# EAGLE design powerlog (EAGLE 5.11)
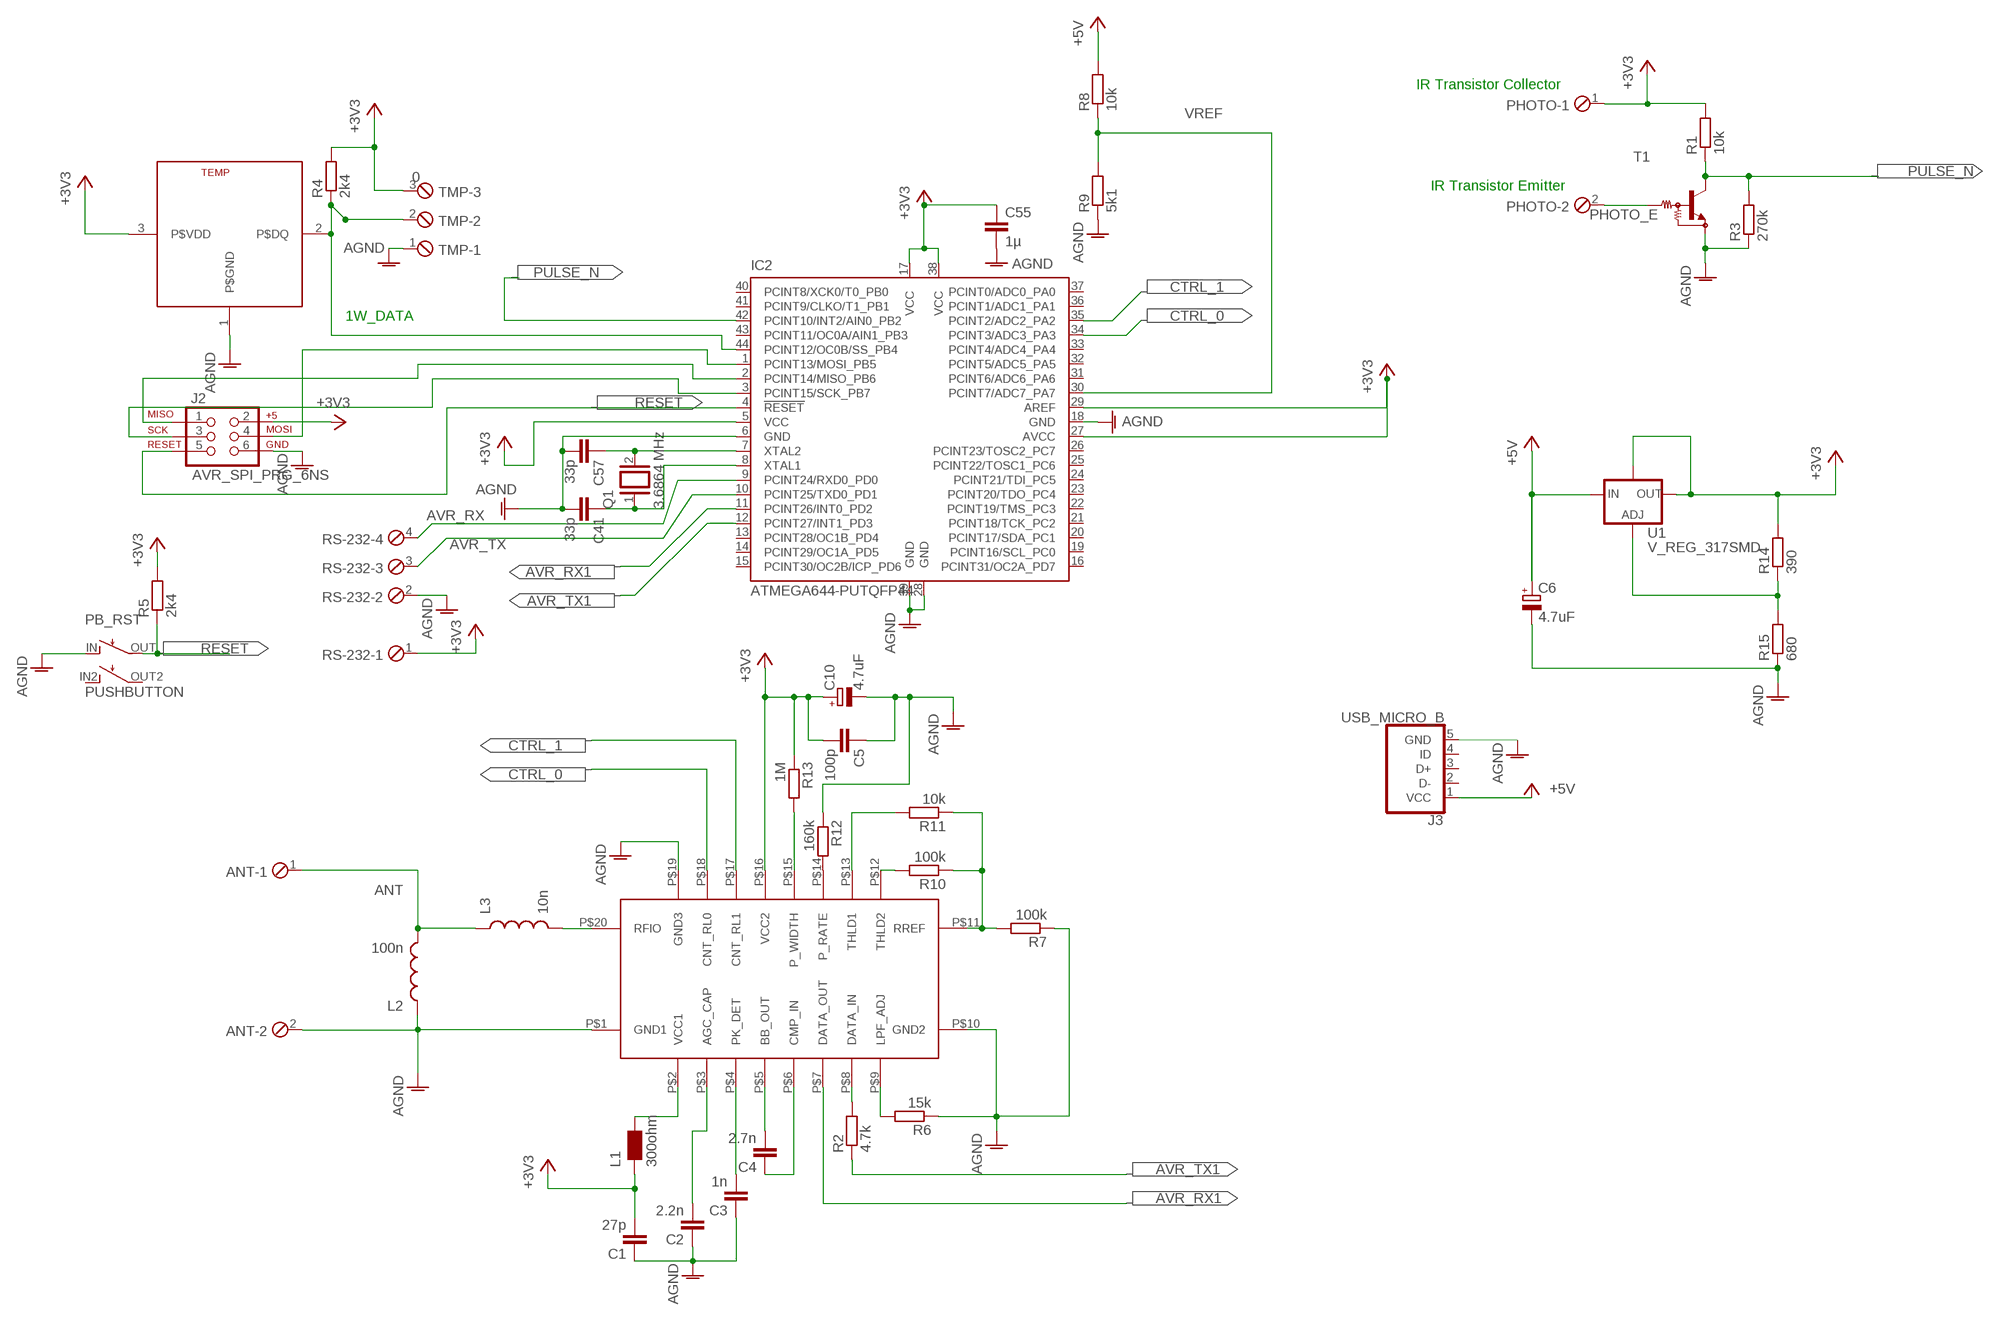
[diagram p0: schematic, sheet 1]

## Parts
ANT  MPT2  [2POL254]
C1  27p  C-EUC0603  [C0603]
C2  2.2n  C-EUC0603  [C0603]
C3  1n  C-EUC0603  [C0603]
C4  2.7n  C-EUC0603  [C0603]
C5  100p  C-EUC0603  [C0603]
C6  4.7uF  CAP_SMBB  [SMC_CAP_B]
C10  4.7uF  CAP_SMBB  [SMC_CAP_B]
C41  33p  C-EUC0603  [C0603]
C55  1µ  C-EUC0805  [C0805]
C57  33p  C-EUC0603  [C0603]
IC2  ATMEGA644-PUTQFP44  [TQFP44]
J2  AVR_SPI_PRG_6NS  [2X3-NS]
J3  USB_MICRO_B  [USB_MICRO_B]
L1  300ohm  WE-CBF_0603  [0603]
L2  100n  INDUCTOR_SMD  [0805]
L3  10n  INDUCTOR_SMD  [0805]
PB_RST  PUSHBUTTON  [PUSHBUTTON]
PHOTO  MPT2  [2POL254]
Q1  3.6864 MHz  XTAL  [Q]
R1  10k  R-EU_R0603  [R0603]
R2  4.7k  R-EU_R0603  [R0603]
R3  270k  R-EU_R0603  [R0603]
R4  2k4  R-EU_R0603  [R0603]
R5  2k4  R-EU_R0603  [R0603]
R6  15k  R-EU_R0603  [R0603]
R7  100k  R-EU_R0603  [R0603]
R8  10k  R-EU_R0603  [R0603]
R9  5k1  R-EU_R0603  [R0603]
R10  100k  R-EU_R0603  [R0603]
R11  10k  R-EU_R0603  [R0603]
R12  160k  R-EU_R0603  [R0603]
R13  1M  R-EU_R0603  [R0603]
R14  390  R-EU_R0603  [R0603]
R15  680  R-EU_R0603  [R0603]
RS-232  MPT4  [4POL254]
T1  NPN-DRIVER  [SC59_EBC]
TEMP  DS18S20T  [TO92-]
TMP  0  MPT3  [3POL254]
U1  V_REG_317SMD  [SOT223]
U$2  TR1001  [TR1001]

## Nets
1W_DATA: IC2.44(PCINT12/OC0B/SS_PB4) R4.1 TEMP.2(P$DQ) TMP.2
+3V3: C1.2 C5.2 C10.+ C55.1 IC2.5(VCC) IC2.17(VCC) IC2.27(AVCC) IC2.29(AREF) IC2.38(VCC) J2.2 L1.1 PHOTO.1 R1.2 R4.2 R5.2 R13.1 R14.2 RS-232.1 TEMP.3(P$VDD) TMP.3 U1.2(OUT) U1.4(OUT_TOP) U$2.P$16(VCC2)
+5V: C6.+ J3.1(VCC) R8.2 U1.3(IN)
AGND: ANT.2 C1.1 C2.1 C3.1 C5.1 C6.- C10.- C41.2 C55.2 C57.2 IC2.6(GND) IC2.18(GND) IC2.28(GND) IC2.39(GND) J2.6 J3.5(GND) L2.1 PB_RST.IN R3.1 R6.1 R7.1 R9.1 R12.1 R15.1 RS-232.2 T1.E TEMP.1(P$GND) TMP.1 U$2.P$1(GND1) U$2.P$10(GND2) U$2.P$19(GND3)
ANT: ANT.1 L2.2 L3.1
AVR_RX: IC2.9(PCINT24/RXD0_PD0) RS-232.4
AVR_RX1: IC2.11(PCINT26/INT0_PD2) U$2.P$7(DATA_OUT)
AVR_TX: IC2.10(PCINT25/TXD0_PD1) RS-232.3
AVR_TX1: IC2.12(PCINT27/INT1_PD3) R2.1
CTRL_0: IC2.34(PCINT3/ADC3_PA3) U$2.P$18(CNT_RL0)
CTRL_1: IC2.35(PCINT2/ADC2_PA2) U$2.P$17(CNT_RL1)
MISO: IC2.2(PCINT14/MISO_PB6) J2.1
MOSI: IC2.1(PCINT13/MOSI_PB5) J2.4
N$1: L3.2 U$2.P$20(RFIO)
N$2: L1.2 U$2.P$2(VCC1)
N$4: C2.2 U$2.P$3(AGC_CAP)
N$5: C3.2 U$2.P$4(PK_DET)
N$6: R14.1 R15.2 U1.1(ADJ)
N$7: C4.2 U$2.P$5(BB_OUT)
N$8: C4.1 U$2.P$6(CMP_IN)
N$10: R2.2 U$2.P$8(DATA_IN)
N$12: R6.2 U$2.P$9(LPF_ADJ)
N$13: R7.2 R10.1 R11.1 U$2.P$11(RREF)
N$15: R10.2 U$2.P$12(THLD2)
N$16: R11.2 U$2.P$13(THLD1)
N$17: R12.2 U$2.P$14(P_RATE)
N$18: R13.2 U$2.P$15(P_WIDTH)
PHOTO_E: PHOTO.2 T1.B
PULSE_N: IC2.42(PCINT10/INT2/AIN0_PB2) R1.1 R3.2 T1.C
RESET: IC2.4(!RESET) J2.5 PB_RST.OUT R5.1
SCK: IC2.3(PCINT15/SCK_PB7) J2.3
VREF: IC2.30(PCINT7/ADC7_PA7) R8.1 R9.2
XTAL1: C41.1 IC2.8(XTAL1) Q1.1
XTAL2: C57.1 IC2.7(XTAL2) Q1.2
Unconnected: IC2.13(PCINT28/OC1B_PD4) IC2.14(PCINT29/OC1A_PD5) IC2.15(PCINT30/OC2B/ICP_PD6) IC2.16(PCINT31/OC2A_PD7) IC2.19(PCINT16/SCL_PC0) IC2.20(PCINT17/SDA_PC1) IC2.21(PCINT18/TCK_PC2) IC2.22(PCINT19/TMS_PC3) IC2.23(PCINT20/TDO_PC4) IC2.24(PCINT21/TDI_PC5) IC2.25(PCINT22/TOSC1_PC6) IC2.26(PCINT23/TOSC2_PC7) IC2.31(PCINT6/ADC6_PA6) IC2.32(PCINT5/ADC5_PA5) IC2.33(PCINT4/ADC4_PA4) IC2.36(PCINT1/ADC1_PA1) IC2.37(PCINT0/ADC0_PA0) IC2.40(PCINT8/XCK0/T0_PB0) IC2.41(PCINT9/CLKO/T1_PB1) IC2.43(PCINT11/OC0A/AIN1_PB3) J3.2(D-) J3.3(D+) J3.4(ID) PB_RST.IN2 PB_RST.OUT2

## Notes on the sheet
- IR Transistor Collector
- IR Transistor Emitter
- 1W_DATA

## Library data of the parts
ANT PHOTO = con-phoenix-254:MPT2: PHOENIX CONNECTOR; OC_FARNELL: unknown; OC_NEWARK: unknown
C1-C5 C41 C55 C57 = rcl:C-EU: CAPACITOR, European symbol
C6 C10 = jockes_lib:CAP_SMB
IC2 = atmel:ATMEGA644-*PU: 8-bit Microcontroller with 64K Bytes In-System Programmable Flash Auto generated by make-symbol-device-package-bsdl.ulp Rev. 34 Source: http://www.atmel.com/dyn/resources/prod_documents/doc2593.pdf
J2 = SparkFun:AVR_SPI_PRG_6: AVR ISP 6 Pin This is the reduced ISP connector for AVR programming. Common on Arduino. This footprint will take up less PCB space and can be used with a 10-pin to 6-pin adapter such as SKU: BOB-08508
J3 = jockes_lib:USB_MICRO_B
L1 = wuerth-elektronik:WE-CBF: SMD EMI Suppression Ferrite Beads - excellent anti-EMI properties - low DCR - impedances till 3000 ohms - rated current up to 6 A
L2 L3 = jockes_lib:INDUCTOR_SMD
PB_RST = jockes_lib:PUSHBUTTON
Q1 = special:XTAL: CRYSTAL
R1-R15 = resistor:R-EU_: RESISTOR, European symbol
RS-232 = con-phoenix-254:MPT4: PHOENIX CONNECTOR; OC_FARNELL: unknown; OC_NEWARK: unknown
T1 = jockes_lib:NPN-DRIVER
TEMP = maxim:DS18S20
TMP = con-phoenix-254:MPT3: PHOENIX CONNECTOR; OC_FARNELL: unknown; OC_NEWARK: unknown
U1 = SparkFun:V_REG_317: Voltage Regulator Standard LM317 adjustable voltage regulator. AOI (Adjust Output Input). Google 'LM317 Calculator' for easy to use app to get the two resistor values needed. 240/720 for 5V output. 240/390 for 3.3V output. Spark Fun Electronics SKU : COM-00527
U$2 = jockes_lib:TR1001

## Board
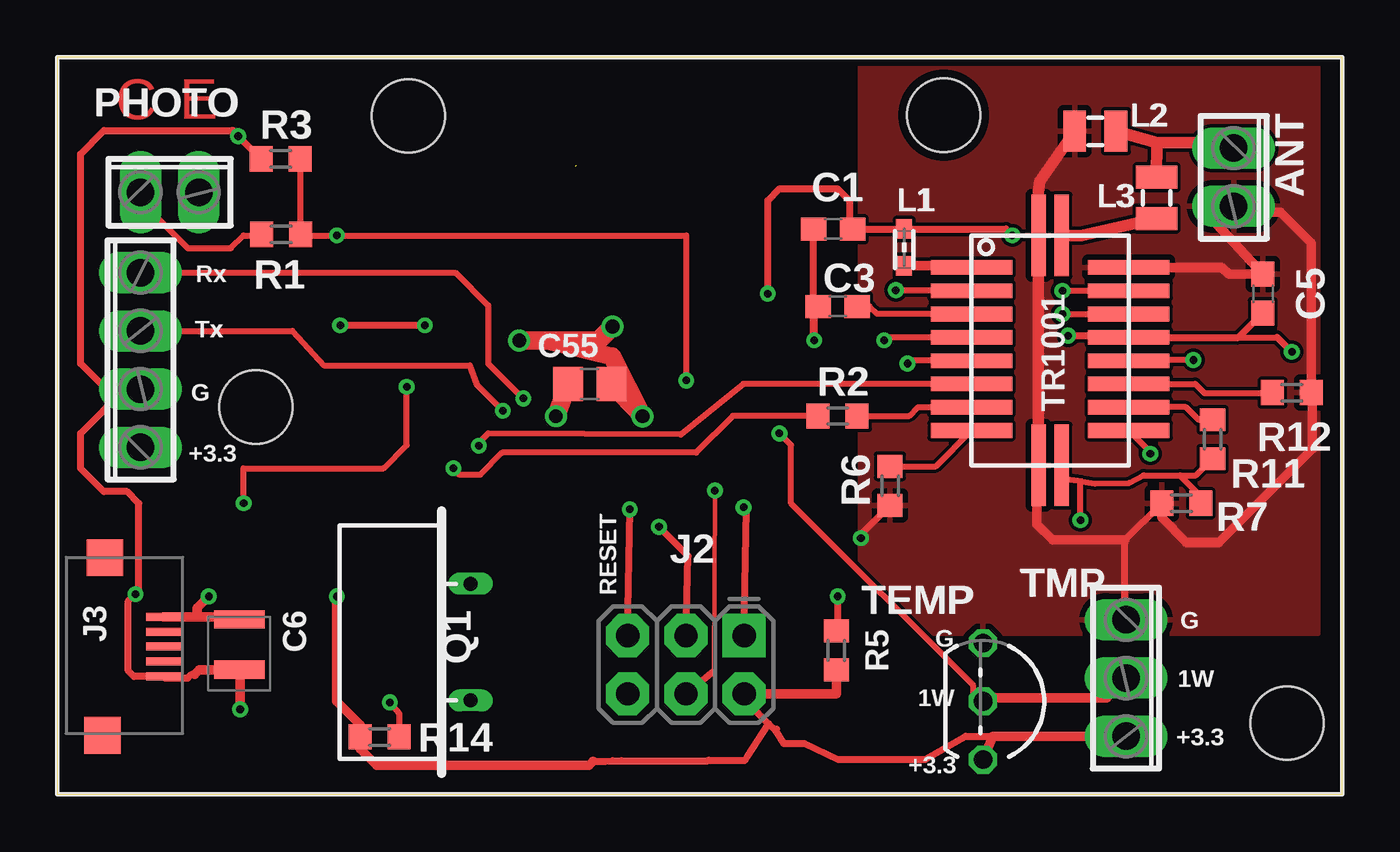
[diagram p1: board, top side]
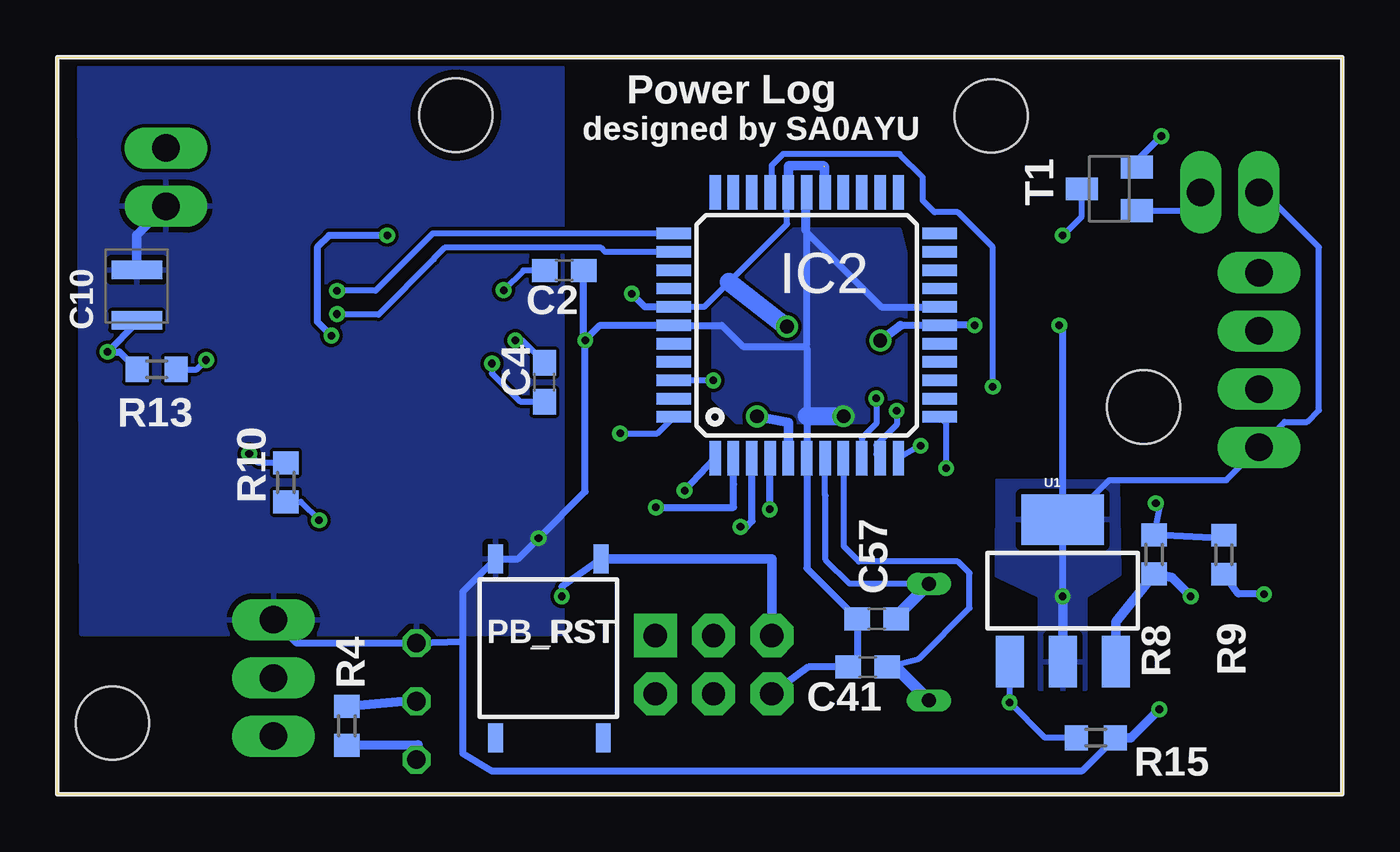
[diagram p2: board, bottom side, seen from below]

Size 56.04 x 32.16 mm. Coordinates in mm from the lower left corner, seen from the top.
Outline: 0,0 56.04,0 56.04,32.16 0,32.16 0,0
Copper layers (1*16): Top 0.0356mm / dielectric 1.5011mm / Bottom 0.0356mm
Design rules "LaenPCBOrder *": minimum track width 6mil, minimum drill 13mil, track to track 6mil, track to pad 6mil, pad to pad 6mil, via to via 6mil, smd to smd 6mil, copper to edge 15mil, drill to drill 6mil, minimum pad ring 7mil, minimum via ring 7mil, stop-mask expansion 4mil, vias tented up to drill 0mil, thermal gap 10mil
Holes 3.2 mm at 38.66,29.63 53.64,3.12 8.66,16.9 15.32,29.6

### Footprints (pad centres in the part's own frame; a part is rotated, then mirrored left to right if it is on the bottom)
2POL254 = drill 1.2 long: 1 -1.27,0; 2 1.27,0
C0603 = smd 1.1 x 1: 1 -0.85,0; 2 0.85,0
SMC_CAP_B = smd 0.8 x 2.2: + -1.37,0.3; - 0.83,0.3
C0805 = smd 1.3 x 1.5: 1 -0.95,0; 2 0.95,0
TQFP44 = smd 1.5 x 0.5: 1 -5.8,4; 2 -5.8,3.2; 3 -5.8,2.4; 4 -5.8,1.6; 5 -5.8,0.8; 6 -5.8,0; 7 -5.8,-0.8; 8 -5.8,-1.6; 9 -5.8,-2.4; 10 -5.8,-3.2; 11 -5.8,-4; 23 5.8,-4; 24 5.8,-3.2; 25 5.8,-2.4; 26 5.8,-1.6; 27 5.8,-0.8; 28 5.8,0; 29 5.8,0.8; 30 5.8,1.6; 31 5.8,2.4; 32 5.8,3.2; 33 5.8,4 | smd 0.5 x 1.5: 12 -4,-5.8; 13 -3.2,-5.8; 14 -2.4,-5.8; 15 -1.6,-5.8; 16 -0.8,-5.8; 17 0,-5.8; 18 0.8,-5.8; 19 1.6,-5.8; 20 2.4,-5.8; 21 3.2,-5.8; 22 4,-5.8; 34 4,5.8; 35 3.2,5.8; 36 2.4,5.8; 37 1.6,5.8; 38 0.8,5.8; 39 0,5.8; 40 -0.8,5.8; 41 -1.6,5.8; 42 -2.4,5.8; 43 -3.2,5.8; 44 -4,5.8
2X3-NS = drill 1.016 pad 1.88 square: 1 -2.54,-1.27 | drill 1.016 pad 1.88 octagon: 2 -2.54,1.27; 3 0,-1.27; 4 0,1.27; 5 2.54,-1.27; 6 2.54,1.27
USB_MICRO_B = smd 0.35 x 1.5: 1 -0.38,-1.58; 2 -1.03,-1.58; 3 -1.68,-1.58; 4 -2.33,-1.58; 5 -2.98,-1.58 | smd 1.6 x 1.6: 6 -5.55,1.08; 7 2.2,0.97
0603 = smd 0.85 x 0.7: 1 -0.9,0; 2 0.7,0
0805 = smd 1 x 1.8: 1 -0.87,0.02; 2 0.93,0.02
PUSHBUTTON = smd 0.635 x 1.27: IN -2.3,4.29; IN2 -2.3,-3.51; OUT 2.3,4.29; OUT2 2.4,-3.51
Q = drill 0.61 long: 1 -2.54,-7.62; 2 2.54,-7.62
R0603 = smd 1 x 1.1: 1 -0.85,0; 2 0.85,0
4POL254 = drill 1.2 long: 1 -3.81,0; 2 -1.27,0; 3 1.27,0; 4 3.81,0
SC59_EBC = smd 1 x 1.4: B -0.95,-1.2; C 0,1.2; E 0.95,-1.2
TO92- = drill 0.813 octagon: 1 -2.54,0; 2 0,0; 3 2.54,0
3POL254 = drill 1.2 long: 1 -2.54,0; 2 0,0; 3 2.54,0
SOT223 = smd 1.219 x 2.235: 1 -2.311,-3.099; 2 0,-3.099; 3 2.311,-3.099 | smd 3.6 x 2.2: 4 0,3.099
TR1001 = smd 3.556 x 0.635: P$1 0,2.921; P$10 10.033,2.921; P$11 10.033,3.937; P$20 0,3.937 | smd 0.635 x 3.556: P$2 1.397,0; P$3 2.413,0; P$4 3.429,0; P$5 4.445,0; P$6 5.461,0; P$7 6.477,0; P$8 7.493,0; P$9 8.509,0; P$12 8.509,6.858; P$13 7.493,6.858; P$14 6.477,6.858; P$15 5.461,6.858; P$16 4.445,6.858; P$17 3.429,6.858; P$18 2.413,6.858; P$19 1.397,6.858

### Placement (x,y rotation side)
ANT  51.31,26.92 270 top
C1  33.84,24.66 0 top
C2  33.93,22.86 180 bottom
C3  34.04,21.29 0 top
C4  34.8,17.98 90 bottom
C5  52.58,21.84 270 top
C6  7.64,6.27 270 top
C10  52.27,22.05 90 bottom
C41  20.69,5.56 180 bottom
C55  23.22,17.9 180 top
C57  20.3,7.66 180 bottom
IC2  23.36,20.47 90 bottom
J2  27.42,5.66 180 top
J3  3.05,8.13 90 top
L1  36.93,23.76 270 top
L2  45.24,28.91 0 top
L3  47.93,26.05 270 top
PB_RST  34.63,5.98 0 bottom
PHOTO  4.9,26.27 0 top
Q1  10.41,6.64 90 top
R1  9.77,24.43 180 top
R2  34.04,16.51 0 top
R3  9.74,27.72 0 top
R4  43.41,3 270 bottom
R5  33.98,6.29 270 top
R6  36.32,13.46 90 top
R7  49.02,12.7 0 top
R8  8.2,10.47 270 bottom
R9  5.16,10.46 90 bottom
R10  46.08,13.61 90 bottom
R11  50.39,15.49 90 top
R12  53.85,17.53 180 top
R13  51.71,18.54 0 bottom
R14  14.06,2.51 180 top
R15  10.75,2.47 180 bottom
RS-232  3.63,18.95 90 top
T1  10.16,26.42 90 bottom
TEMP  40.38,4.06 270 top
TMP  46.62,5.08 270 top
U1  12.19,8.89 0 bottom
U$2  39.88,24.38 270 top

### Tracks (layer width: path | path; a pad name or v marks a point on that pad's centre or on a via)
1W_DATA  (via drill 0.33)
  Top 0.254: 39.96,4.22 39.96,4.75 32,12.7 32,15.24 v31.5,15.75
  Top 0.406: TMP.2 46.62,5.06 45.77,4.22 39.96,4.22 TEMP.2
  Bottom 0.254: v31.5,15.75 29.87,15.75 IC2.44
  Bottom 0.406: R4.1 40.45,4.1 TEMP.2
+3V3  (via drill 0.33, 0.6)  (1 unrouted)
  Top 0.152: TEMP.3 40.39,2.03 | 24.22,1.47 24.13,1.37
  Top 0.254: PHOTO.1 3.63,25.89 5.69,23.82 7.57,23.82 8.13,24.38 8.88,24.38 R1.2 | 51.52,19.94 53.21,19.94
  Top 0.305: v24.21,20.41 24.52,20.26 | 23.37,1.43 23.91,1.44 24.22,1.47 24.6,1.47 28.39,1.47 28.41,1.49 30.02,1.49 30.11,1.66 31.02,3.08 | 31.02,3.08 31.32,2.79 | 31.02,3.08 30.56,3.54 J2.2 | 31.32,2.79 31.68,2.22 32.59,2.22 34.06,1.52 37.85,1.52 39.62,2.53 40.81,2.53 | 31.32,2.79 31.37,2.84 | v12.34,20.47 v16.03,20.47 | v30.99,21.84 30.99,25.91 31.5,26.42 34.04,26.42 34.54,25.91 34.54,24.8 C1.2 L1.1 41.38,24.66 v41.66,24.38 | v44.09,20.01 46.66,20.01 U$2.P$16 51.52,19.94 C5.2 | 53.21,19.94 v53.85,19.3
  Top 0.406: TMP.3 40.81,2.53 TEMP.3 | R5.2 33.98,4.39 J2.2 | v12.19,8.64 12.19,4.06 13.21,3.04 R14.2 13.21,1.98 13.92,1.27 23.2,1.27 23.37,1.43
  Top 0.813: v20.15,19.8 21.35,19.8 | 21.35,19.8 24.19,19.11 v25.53,16.49 C55.1 | 21.35,19.8 23.6,19.8 v24.21,20.41
  Bottom 0.254: IC2.38 27.83,21.27 26.75,22.34 24.21,24.88 24.21,26.21 IC2.29 | v12.19,8.64 12.19,11.68 10.16,13.72 5.05,13.72 RS-232.1 2.51,16.26 1.52,16.26 1.02,16.76 1.02,23.88 3.41,26.27 PHOTO.1
  Bottom 0.305: v24.21,20.41 24.47,20.56 | v12.34,20.47 12.19,20.32 v12.19,8.64 | IC2.38 30.41,21.27 v30.99,21.84 | v41.66,24.38 44.2,24.38 44.7,23.88 44.7,20.62 v44.09,20.01 | R13.1 53.33,19.3 v53.85,19.3 52.57,20.58 C10.+ | 19.26,20.46 17.55,20.46 IC2.17 v16.03,20.47
  Bottom 0.406: 19.26,20.46 v20.15,19.8 | IC2.29 24.16,27.41 24.13,27.43 22.63,27.43 | 22.58,27.38 22.58,26.29 IC2.27 | R4.2 40.31,2.17 TEMP.3 | IC2.5 24.16,16.23 v25.53,16.49 | v12.19,8.64 U1.2
  Bottom 0.813: 24.47,20.56 26.75,22.34
  pour Bottom: 13.21,4.57 13.21,8.64 15.09,9.52 15.06,13.72 9.75,13.67 9.7,9.6 11.18,8.64 11.18,4.57
+5V  (via drill 0.33)
  Top 0.406: J3.1 6.1,7.75 | 6.1,7.75 7.83,7.75 C6.+ | v6.6,8.64 6.1,8.13 6.1,7.75
  Bottom 0.406: v6.6,8.64 7.43,9.46 R8.2 9.88,7.53 U1.3
AGND  (via drill 0.33, 0.6)
  Top 0.305: 5.99,5.23 5.84,5.23 5.69,5.08 4.7,5.08 J3.5 3.34,5.15 3.1,5.38 3.1,8.43 v3.4,8.74 3.56,8.89 3.56,12.7 3.05,13.21 2.03,13.21 1.02,14.22 1.02,15.75 2.95,17.68 | 2.95,17.68 RS-232.2 | 2.95,17.68 2.13,17.68 1.02,18.8 1.02,27.94 2.03,28.96 7.62,28.96 | 7.62,28.96 7.65,28.96 v7.89,28.72 | v7.89,28.72 R3.1 | v7.89,28.72 7.86,28.72 7.62,28.96 | C3.1 33.02,21.12 v33.02,19.81 32.99,19.84 C1.1 | 46.57,7.67 46.57,11.09 R7.1 | v35.05,11.18 35.05,11.34 R6.1
  Top 0.406: TMP.1 46.57,7.67 | v7.98,3.71 7.98,5.4 C6.- 6.2,5.44 5.99,5.23 | 46.57,11.09 43.42,11.09 42.72,11.79 42.72,14.27 U$2.P$10 | R7.1 48.17,12.08 49.25,11 50.67,11 54.74,15.06 54.74,17.49 R12.1 54.7,24.04 53.34,25.4 51.56,25.4 ANT.2 50.55,24.89 C5.1 51.09,22.69 50.8,22.99 U$2.P$19
  Top 0.508: U$2.P$10 U$2.P$1 42.8,26.29 42.85,26.75 L2.1
  Top 0.813: v21.75,16.5 C55.2
  Bottom 0.305: IC2.18 20.09,21.27 23.45,24.63 23.45,26.17 IC2.28 23.36,19.64 23.45,19.55 | 23.45,19.55 26.14,19.55 27.06,20.46 IC2.39 32.37,20.47 v33.02,19.81 | 23.45,19.55 23.36,19.45 23.36,16.51 IC2.6 23.36,9.86 C57.2 21.15,5.95 C41.2 23.28,5.56 J2.6 | 38.35,6.65 TEMP.1 45.6,6.6 TMP.1 | v3.4,8.74 4.52,8.74 R9.1 | T1.E 8.96,27.64 v7.89,28.72 | C2.1 33.08,19.88 v33.02,19.81 | 38.35,6.65 38.35,1.78 37.08,1.02 11.36,1.02 R15.1 | 38.35,6.65 38.35,8.84 PB_RST.IN 35.96,10.27 v35.05,11.18 33.02,13.21 v33.02,19.81
  Bottom 0.406: TMP.1 | R15.1 9.21,2.47 v7.98,3.71 | C10.- 52.57,24.39 ANT.2
  Bottom 0.813: 23.36,16.51 v21.75,16.5
  pour Bottom: 19.3,24.64 26.92,24.64 27.43,24.13 27.43,17.27 26.42,16.26 19.56,16.26 19.05,16.76 19.05,23.62
  pour Top: 35,32 55,32 55,7 36,7 35,7
  pour Bottom: 34.01,31.7 55.09,31.7 55,7 34,7 34,31
ANT
  Top 0.508: 47.97,28.42 L3.1 | L2.2 47.97,28.42 | 47.97,28.42 51.08,28.42 ANT.1
AVR_RX  (via drill 0.33)
  Top 0.254: RS-232.4 17.37,22.76 18.8,21.34 18.8,18.8 v20.32,17.27
  Bottom 0.152: IC2.9 20.83,14.99
  Bottom 0.254: v20.32,17.27 20.32,16.18 20.96,15.54 IC2.9 | IC2.9
AVR_RX1  (via drill 0.33)
  Top 0.254: U$2.P$7 29.92,17.91 27.2,15.7 18.8,15.75 18.26,15.21 v18.39,15.21
  Bottom 0.254: v18.39,15.21 19.34,14.68 IC2.11
AVR_TX  (via drill 0.33)
  Top 0.254: RS-232.3 10.26,20.22 11.63,18.72 17.98,18.72 18.29,17.88 v19.43,16.74
  Bottom 0.254: v19.43,16.74 19.43,16.13 20.32,15.24 20.32,14.83 IC2.10
AVR_TX1  (via drill 0.33)
  Top 0.254: R2.1 29.46,16.51 27.86,14.91 19.41,14.91 18.44,13.94 17.55,13.94 v17.27,14.22
  Bottom 0.254: v17.27,14.22 17.27,16.18 IC2.12
CTRL_0  (via drill 0.33)
  Top 0.254: v43.84,21.97 U$2.P$18
  Bottom 0.254: IC2.34 39.67,24.47 42.16,21.97 v43.84,21.97
CTRL_1  (via drill 0.33)
  Top 0.254: v43.84,20.95 U$2.P$17
  Bottom 0.254: IC2.35 32.15,23.67 32.33,23.85 39.14,23.85 39.62,23.37 39.62,23.34 42.04,20.93 43.82,20.93 v43.84,20.95
MISO  (via drill 0.33)
  Top 0.305: v29.93,12.52 29.92,12.49 30.06,12.43 J2.1
  Bottom 0.305: v29.93,12.52 26.55,12.52 26.55,13.53 26.55,14.66 IC2.2
MOSI  (via drill 0.33)
  Top 0.203: 28.64,5.38 v28.68,13.25
  Top 0.305: J2.4 28.64,5.38
  Bottom 0.305: v28.68,13.25 IC2.1
N$1
  Top 0.508: U$2.P$20 44.67,24.38 L3.2
N$2
  Top 0.406: L1.2 39.8,23.06 U$2.P$2
N$4  (via drill 0.33)
  Top 0.254: v36.58,22 39.85,22 U$2.P$3
  Bottom 0.254: C2.2 35.71,22.86 v36.58,22
N$5
  Top 0.254: U$2.P$4 35.76,20.95 35.43,21.28 C3.2
N$6  (via drill 0.33)
  Top 0.254: R14.1 14.91,3.53 v14.5,4.01
  Bottom 0.254: U1.1 v14.5,4.01 12.96,2.47 R15.2
N$7  (via drill 0.33)
  Top 0.254: U$2.P$5 36.2,19.94 v36.07,19.81
  Bottom 0.254: v36.07,19.81 35.78,19.81 C4.2
N$8  (via drill 0.33)
  Top 0.254: U$2.P$6 37.21,18.92 v37.08,18.8
  Bottom 0.254: v37.08,18.8 37.08,18.36 35.87,17.14 34.81,17.14 C4.1
N$10
  Top 0.254: R2.2 37.16,16.51 37.54,16.89 U$2.P$8
N$12
  Top 0.254: R6.2 38.32,14.31 U$2.P$9
N$13  (via drill 0.33)
  Top 0.254: U$2.P$11 43.82,13.77 44.69,13.64 | 44.69,13.64 45.26,13.56 46.76,13.59 47.37,13.92 48.97,13.92 | 48.97,13.92 49.82,13.07 49.82,12.75 R7.2 | v44.63,11.96 44.63,13.58 44.69,13.64 | 48.97,13.92 49.67,13.92 R11.1
  Bottom 0.254: R10.1 45.43,12.76 v44.63,11.96
N$15  (via drill 0.33)
  Top 0.254: v47.68,14.86 47.68,14.93 U$2.P$12
  Bottom 0.254: R10.2 47.28,14.46 v47.68,14.86
N$16
  Top 0.254: R11.2 49.77,16.34 49.23,16.89 U$2.P$13
N$17
  Top 0.254: U$2.P$14 49.63,17.91 50.04,17.5 52.97,17.5 R12.2
N$18  (via drill 0.33)
  Top 0.254: v49.56,18.95 46.76,18.95 U$2.P$15
  Bottom 0.254: R13.2 49.96,18.54 v49.56,18.95
PHOTO_E
  Bottom 0.254: T1.B 6.97,25.47 PHOTO.2
PULSE_N  (via drill 0.33)
  Top 0.254: R3.2 10.62,27.69 R1.1 10.66,24.38 v12.19,24.38 27.43,24.38 v27.43,18.06
  Bottom 0.254: T1.C 11.36,25.22 v12.19,24.38 | v27.43,18.06 29.15,18.06 IC2.42
RESET  (via drill 0.33)
  Top 0.305: J2.5 v24.97,12.43 | R5.1 34.04,7.14 v34.04,8.64
  Bottom 0.305: IC2.4 24.96,12.45 v24.97,12.43 | v34.04,8.64 34.04,9.07 PB_RST.OUT
  Bottom 0.406: PB_RST.OUT 24.88,10.27 J2.5
SCK  (via drill 0.33)
  Top 0.305: v26.24,11.67 27.52,10.4 J2.3
  Bottom 0.305: v26.24,11.67 25.99,11.67 25.74,11.93 25.74,14.65 IC2.3
VREF  (via drill 0.33)
  Top 0.254: v8.13,12.7 8.13,14.22 14.22,14.22 15.24,15.24 v15.24,17.78
  Bottom 0.254: R8.1 7.95,12.52 v8.13,12.7 | v15.24,17.78 15.24,23.88 16.76,25.4 17.78,25.4 18.29,25.91 18.29,26.92 19.3,27.94 24.38,27.94 24.89,27.43 24.89,26.33 IC2.30
  Bottom 0.305: R8.1 5.25,11.16 R9.2
XTAL1
  Bottom 0.254: C41.1 18.47,5.91 16.26,8.13 16.26,9.65 16.76,10.16 21.08,10.16 21.74,10.82 21.74,14.65 IC2.8
  Bottom 0.305: IC2.8 21.67,14.58
  Bottom 0.508: C41.1 19.49,5.56 Q1.1
XTAL2
  Bottom 0.254: IC2.7 22.56,13.05 22.53,13.02 22.53,10.24 21.48,9.18 Q1.2
  Bottom 0.508: C57.1 19.45,7.76 Q1.2

### Text on the board
Top: C | E
tNames: Rx | Tx | G | +3.3 | RESET | G | G | 1W | 1W | +3.3 | +3.3
bNames: Power Log | designed by SA0AYU
_tsilk: PHOTO | ANT | R3 | L2 | C1 | L3 | L1 | R1 | C5 | Rx | C3 | TR1001 | Tx | C55 | G | R2 | R12 | R11 | +3.3 | R6 | R7 | J2 | TMP | RESET | J3 | C6 | TEMP | G | Q1 | G | R5 | 1W | 1W | R14 | +3.3 | +3.3
_bsilk: Power Log | designed by SA0AYU | T1 | IC2 | C2 | C10 | C4 | R13 | U1 | R10 | C57 | R8 | PB_RST | R4 | R9 | C41 | R15